# EAGLE design NESRGB-IGR (EAGLE 6.5.0)
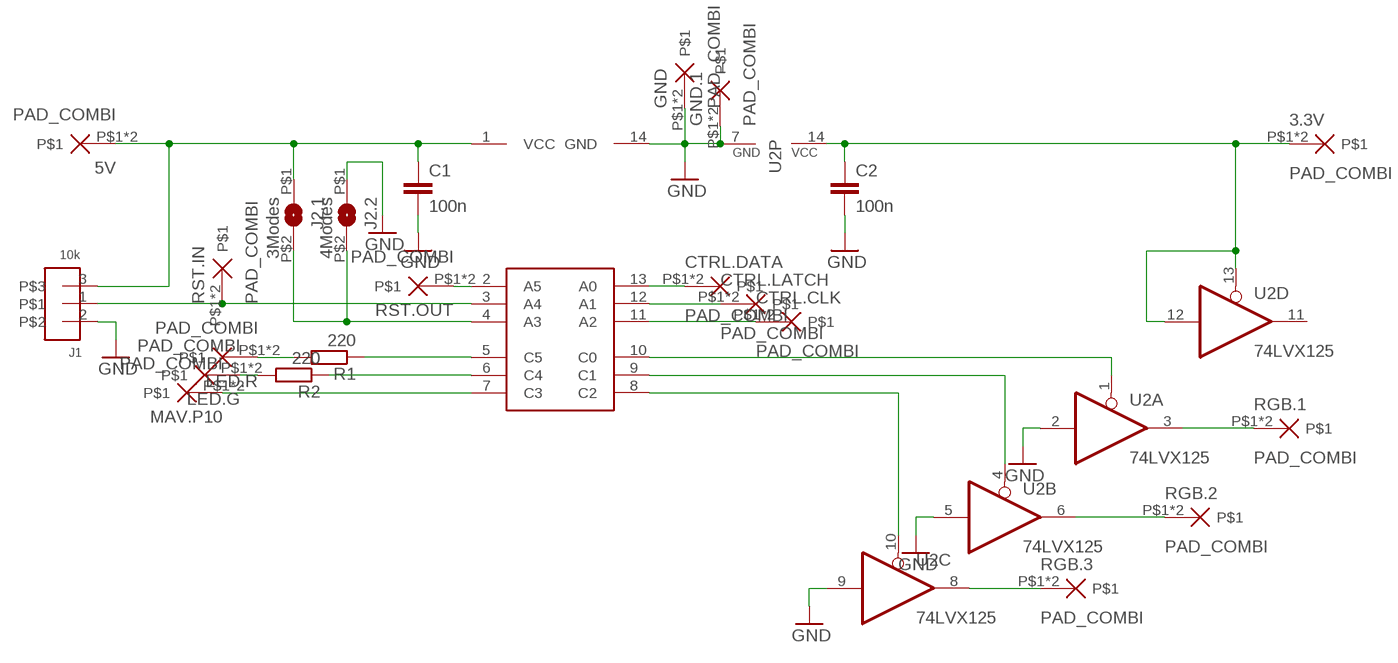
[diagram p0: schematic, sheet 1]

## Parts
3.3V  PAD_COMBI  [PAD_COMBI]
5V  PAD_COMBI  [PAD_COMBI]
C1  100n  C0805  [Z0805]
C2  100n  C0805  [Z0805]
CTRL.CLK  PAD_COMBI  [PAD_COMBI]
CTRL.DATA  PAD_COMBI  [PAD_COMBI]
CTRL.LATCH  PAD_COMBI  [PAD_COMBI]
GND  PAD_COMBI  [PAD_COMBI]
GND.1  PAD_COMBI  [PAD_COMBI]
J1  10k  Z0805-JUMPER  [Z0805-JUMPER]
J2.1  3Modes  MY_JUMPER  [MYJUMP]
J2.2  4Modes  MY_JUMPER  [MYJUMP]
LED.G  PAD_COMBI  [PAD_COMBI]
LED.R  PAD_COMBI  [PAD_COMBI]
MAV.P10  PAD_COMBI  [PAD_COMBI]
R1  220  R0805  [Z0805]
R2  220  R0805  [Z0805]
RGB.1  PAD_COMBI  [PAD_COMBI]
RGB.2  PAD_COMBI  [PAD_COMBI]
RGB.3  PAD_COMBI  [PAD_COMBI]
RST.IN  PAD_COMBI  [PAD_COMBI]
RST.OUT  PAD_COMBI  [PAD_COMBI]
U1  PIC16F684  PIC16F630_SIMPLE  [PIC16F630]
U2  74LVX125  74HC125D  [SO14]

## Nets
GND: C1.2 C2.2 GND.1.P$1 GND.1.P$2 GND.P$1 GND.P$2 J1.2 J2.2.P$1 U1.14(GND) U2.2(A:I) U2.5(B:I) U2.7(P:GND) U2.9(C:I)
N$1: J1.1 RST.IN.P$1 RST.IN.P$2 U1.3(A4)
N$2: 5V.P$1 5V.P$2 C1.1 J1.3 J2.1.P$1 U1.1(VCC)
N$3: R2.1 U1.6(C4)
N$7: J2.1.P$2 J2.2.P$2 U1.4(A3)
N$8: MAV.P10.P$1 MAV.P10.P$2 U1.7(C3)
N$9: 3.3V.P$1 3.3V.P$2 C2.1 U2.12(D:I) U2.13(D:OE) U2.14(P:VCC)
N$10: CTRL.DATA.P$1 CTRL.DATA.P$2 U1.13(A0)
N$11: CTRL.LATCH.P$1 CTRL.LATCH.P$2 U1.12(A1)
N$12: CTRL.CLK.P$1 CTRL.CLK.P$2 U1.11(A2)
N$13: LED.G.P$1 LED.G.P$2 R2.2
N$14: LED.R.P$1 LED.R.P$2 R1.2
N$15: RST.OUT.P$1 RST.OUT.P$2 U1.2(A5)
N$16: U1.10(C0) U2.1(A:OE)
N$17: U1.9(C1) U2.4(B:OE)
N$18: U1.8(C2) U2.10(C:OE)
N$19: R1.1 U1.5(C5)
N$20: RGB.3.P$1 RGB.3.P$2 U2.8(C:O)
N$21: RGB.2.P$1 RGB.2.P$2 U2.6(B:O)
N$22: RGB.1.P$1 RGB.1.P$2 U2.3(A:O)
Unconnected: U2.11(D:O)

## Library data of the parts
3.3V 5V CTRL.CLK CTRL.DATA CTRL.LATCH GND GND.1 LED.G LED.R MAV.P10 RGB.1-RGB.3 RST.IN RST.OUT = MS_Mod:PAD_COMBI
C1 C2 = snes_div:C0805
J1 = snes_div:Z0805-JUMPER
J2.1 J2.2 = snes_div:MY_JUMPER
R1 R2 = snes_div:R0805
U1 = snes_div:PIC16F630_SIMPLE
U2 = 74xx-eu:74*125: Quad bus BUFFER, 3-state

## Board
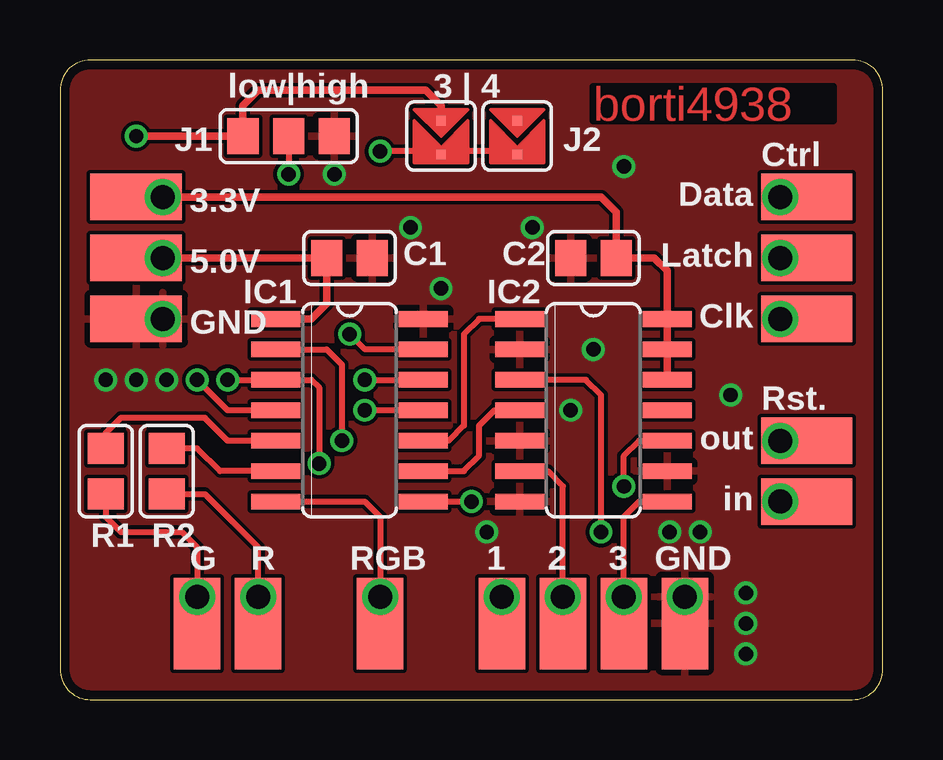
[diagram p1: board, top side]
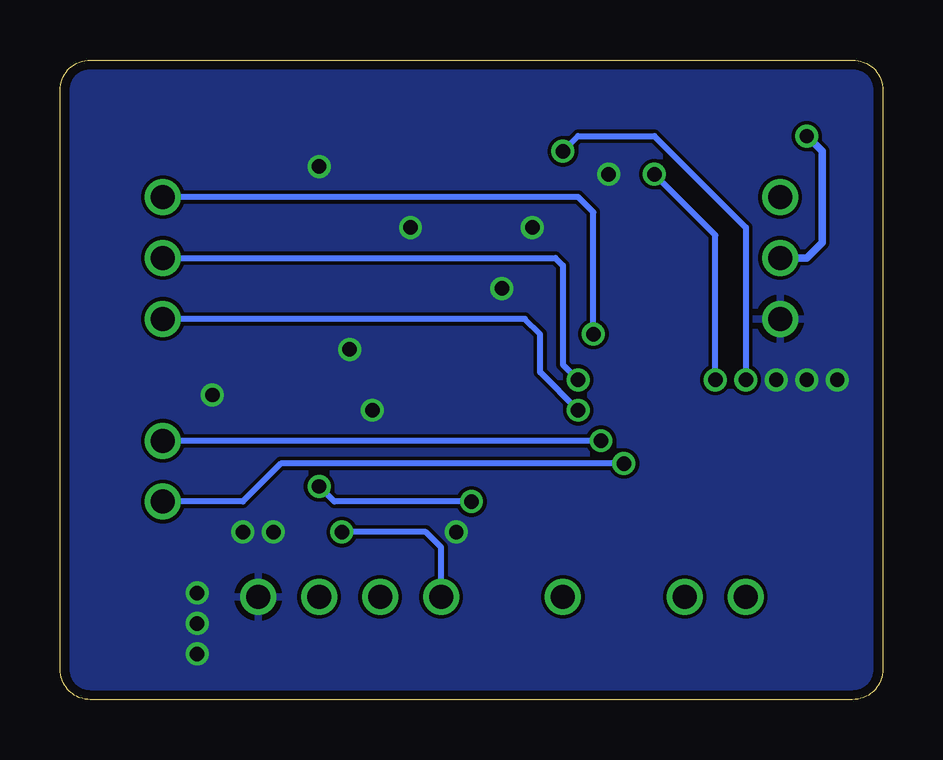
[diagram p2: board, bottom side, seen from below]

Size 34.29 x 26.67 mm. Coordinates in mm from the lower left corner, seen from the top.
Outline: 1.27,0 33.02,0 arc90 34.29,1.27 34.29,25.4 arc90 33.02,26.67 1.27,26.67 arc90 0,25.4 0,1.27 arc90 1.27,0
Copper layers (1*16): Top 0.0356mm / dielectric 1.5011mm / Bottom 0.0356mm
Design rules "LaenPCBOrder": minimum track width 6mil, minimum drill 13mil, track to track 6mil, track to pad 6mil, pad to pad 6mil, via to via 6mil, smd to smd 6mil, copper to edge 15mil, drill to drill 6mil, minimum pad ring 7mil, minimum via ring 7mil, stop-mask expansion 3mil, vias tented up to drill 0mil, thermal gap 10mil

### Footprints (pad centres in the part's own frame; a part is rotated, then mirrored left to right if it is on the bottom)
PAD_COMBI = smd 1.93 x 3.81: P$1 0,0 | drill 1: P$2 0,1.111
Z0805 = smd 1.3 x 1.5: 1 -0.95,0; 2 0.95,0
Z0805-JUMPER = smd 1.3 x 1.5: 1 0,0; 2 -1.9,0; 3 1.9,0
MYJUMP = smd 0.406 x 0.406: P$1 -0.635,0; P$2 0.765,0
PIC16F630 = smd 0.66 x 2.032: 1 -3.81,-3.073; 2 -2.54,-3.073; 3 -1.27,-3.073; 4 0,-3.073; 5 1.27,-3.073; 6 2.54,-3.073; 7 3.81,-3.073; 8 3.81,3.073; 9 2.54,3.073; 10 1.27,3.073; 11 0,3.073; 12 -1.27,3.073; 13 -2.54,3.073; 14 -3.81,3.073
SO14 = smd 0.66 x 2.032: 1 -3.81,-3.073; 2 -2.54,-3.073; 3 -1.27,-3.073; 4 0,-3.073; 5 1.27,-3.073; 6 2.54,-3.073; 7 3.81,-3.073; 8 3.81,3.073; 9 2.54,3.073; 10 1.27,3.073; 11 0,3.073; 12 -1.27,3.073; 13 -2.54,3.073; 14 -3.81,3.073

### Placement (x,y rotation side)
3.3V  3.17,20.95 270 top
5V  3.17,18.41 270 top
C1  12.07,18.41 0 top
C2  22.23,18.41 180 top
CTRL.CLK  31.12,15.88 90 top
CTRL.DATA  31.12,20.95 90 top
CTRL.LATCH  31.12,18.41 90 top
GND  26.04,3.17 0 top
GND.1  3.17,15.88 270 top
J1  9.52,23.5 180 top
J2.1  15.88,23.5 270 top
J2.2  19.05,23.5 270 top
LED.G  8.25,3.17 0 top
LED.R  5.72,3.17 0 top
MAV.P10  13.34,3.17 0 top
R1  1.91,9.53 270 top
R2  4.45,9.53 270 top
RGB.1  18.41,3.17 0 top
RGB.2  20.96,3.17 0 top
RGB.3  23.5,3.17 0 top
RST.IN  31.12,8.26 90 top
RST.OUT  31.12,10.79 90 top
U1  12.07,12.06 270 top
U2  22.23,12.06 270 top

### Tracks (layer width: path | path; a pad name or v marks a point on that pad's centre or on a via)
GND  (via drill 0.6)
  Top 0.254: GND.1.P$1 GND.1.P$2 | GND.P$1 GND.P$2
  other vias: 25.4,6.99 26.67,6.99 27.94,12.7 22.23,14.61 21.27,12.06 14.61,19.68 19.69,19.68 23.5,22.23 11.43,21.91 4.45,13.34 3.17,13.34 1.91,13.34 28.57,4.45 28.57,3.17 28.57,1.91 15.88,17.14 17.78,6.99
  pour Bottom: 0,0 34.29,0 34.29,26.67 0,26.67
  pour Top: 0,0 34.29,0 34.29,26.67 0,26.67
N$1  (via drill 0.6)
  Top 0.254: RST.IN.P$1 RST.IN.P$2 | J1.1 v9.52,21.91 | v6.99,13.34 U1.3 10.48,13.34 10.8,13.02 v10.8,9.84
  Bottom 0.254: v10.8,9.84 25.08,9.84 26.67,8.26 RST.IN.P$2 | v6.99,13.34 6.99,19.37 v9.52,21.91
N$2  (via drill 0.6)
  Top 0.305: U1.1 10.48,15.88 11.11,16.51 C1.1 5V.P$2 5V.P$1 | J2.1.P$1 15.88,24.77 15.24,25.4 8.25,25.4 7.62,24.77 J1.3 v3.17,23.5
  Bottom 0.305: v3.17,23.5 2.54,22.86 2.54,19.05 5V.P$1 5V.P$2
N$3
  Top 0.254: U1.6 6.67,9.53 5.72,10.48 R2.1 | R2.1 | R2.1
N$7  (via drill 0.6)
  Top 0.254: J2.2.P$2 19.05,22.86 16.01,22.86 J2.1.P$2 15.37,22.73 15.24,22.86 v13.34,22.86 | U1.4 6.99,12.06 v5.72,13.34
  Bottom 0.254: v13.34,22.86 12.7,23.5 9.52,23.5 5.72,19.68 v5.72,13.34
N$8
  Top 0.254: MAV.P10.P$1 MAV.P10.P$2 13.34,7.62 12.7,8.26 U1.7
N$9
  Top 0.254: 3.3V.P$1 3.3V.P$2
  Top 0.305: U2.12 U2.13 U2.14 25.3,17.88 24.77,18.41 C2.1 23.18,20.32 22.54,20.95 3.3V.P$2
N$10  (via drill 0.6)
  Top 0.254: CTRL.DATA.P$1 CTRL.DATA.P$2 | U1.13 12.7,14.61 v12.07,15.24
  Bottom 0.254: v12.07,15.24 12.07,20.32 12.7,20.95 CTRL.DATA.P$2
N$11  (via drill 0.6)
  Top 0.254: CTRL.LATCH.P$1 CTRL.LATCH.P$2 | v12.7,13.34 U1.12
  Bottom 0.254: CTRL.LATCH.P$2 13.65,18.41 13.34,18.1 13.34,13.97 v12.7,13.34
N$12  (via drill 0.6)
  Top 0.254: CTRL.CLK.P$1 CTRL.CLK.P$2 | U1.11 v12.7,12.06
  Bottom 0.254: v12.7,12.06 14.29,13.65 14.29,15.24 14.92,15.88 CTRL.CLK.P$2
N$13
  Top 0.254: LED.G.P$1 LED.G.P$2 8.25,6.35 6.03,8.57 R2.2
N$14
  Top 0.254: LED.R.P$1 LED.R.P$2 5.72,6.35 5.08,6.99 2.54,6.99 1.91,7.62 R1.2
N$15  (via drill 0.6)
  Top 0.254: RST.OUT.P$1 RST.OUT.P$2 | U1.2 11.11,14.61 11.75,13.97 v11.75,10.79
  Bottom 0.254: v11.75,10.79 RST.OUT.P$2
N$16
  Top 0.254: U2.1 17.46,15.88 16.83,15.24 16.83,11.43 16.19,10.79 U1.10
N$17
  Top 0.254: U1.9 16.83,9.53 17.46,10.16 17.46,11.43 18.1,12.06 U2.4
N$18  (via drill 0.6)
  Top 0.254: U1.8 v17.14,8.26 | v23.5,8.89 23.5,10.16 24.13,10.79 U2.10
  Bottom 0.254: v17.14,8.26 22.86,8.26 v23.5,8.89
N$19
  Top 0.254: U1.5 6.99,10.79 6.03,11.75 2.54,11.75 1.91,11.11 R1.1
N$20
  Top 0.254: U2.8 24.13,8.26 23.5,7.62 RGB.3.P$2 RGB.3.P$1
N$21
  Top 0.254: U2.6 20.32,9.53 20.96,8.89 RGB.2.P$2 RGB.2.P$1
N$22  (via drill 0.6)
  Top 0.254: v22.54,6.99 22.54,12.7 21.91,13.34 U2.3 | RGB.1.P$1 RGB.1.P$2
  Bottom 0.254: RGB.1.P$2 18.41,6.35 19.05,6.99 v22.54,6.99

### Text on the board
Top: borti4938
tNames: low|high | 3 | 4 | J1 | J2 | Data | Ctrl | 3.3V | Latch | 5.0V | C1 | C2 | IC1 | IC2 | Clk | GND | Rst. | out | in | R1 | R2 | G | R | RGB | 1 | 2 | 3 | GND
tStop: b | o | r | t | i | 4 | 9 | 3 | 8